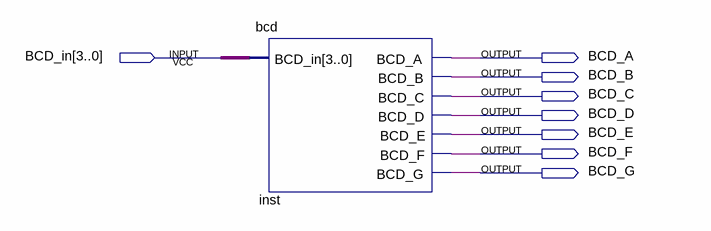
[diagram p0: schematic sheet]
// Quartus schematic test.bdf as structural Verilog: 1 symbols, 8 pins
module test (
  input  [3:0] BCD_in,
  output BCD_A,
  output BCD_B,
  output BCD_C,
  output BCD_D,
  output BCD_E,
  output BCD_F,
  output BCD_G
);

  bcd inst (
    .BCD_in(BCD_in), .BCD_A(BCD_A), .BCD_B(BCD_B), .BCD_C(BCD_C), .BCD_D(BCD_D), .BCD_E(BCD_E),
    .BCD_F(BCD_F), .BCD_G(BCD_G));
endmodule
